# EAGLE design Motherboard (EAGLE 9.1.0)
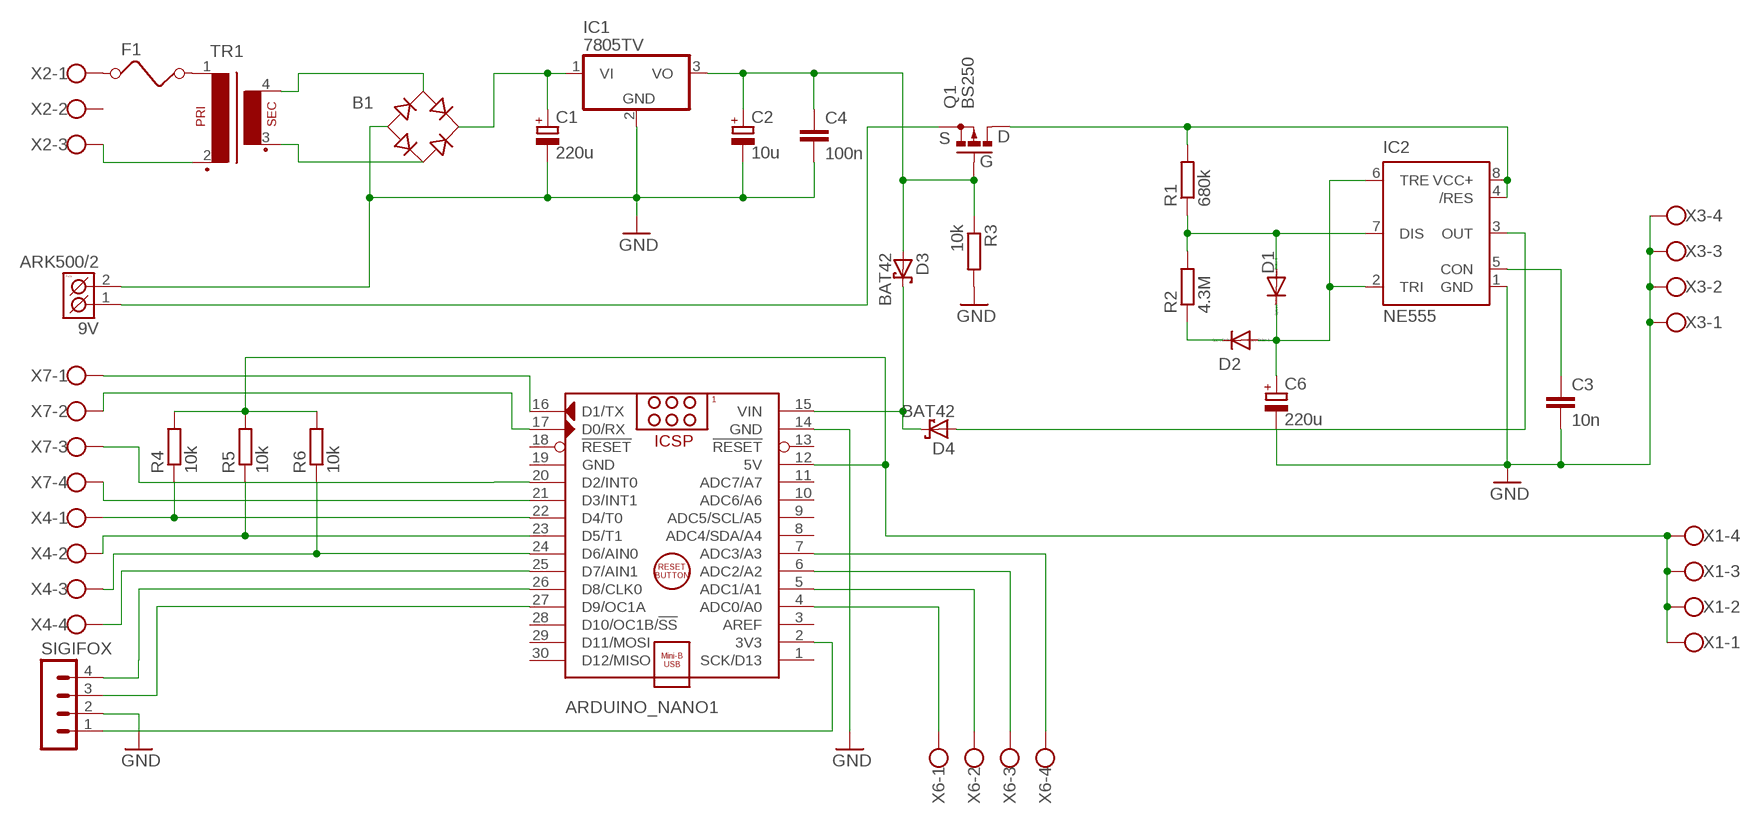
[diagram p0: schematic, sheet 1]

## Parts
9V  ARK500/2  [ARK500/2]
ARDUINO_NANO1  ARDUINO_NANO  [ARDUINO_NANO]
B1  RECTIFIER-RB1A  [RB1A]
C1  220u  CPOL-EUE5-13  [E5-13]
C2  10u  CPOL-EUE2,5-6E  [E2,5-6E]
C3  10n  C2.5/2  [C2.5-2]
C4  100n  C2.5/2  [C2.5-2]
C6  220u  CPOL-EUE5-13  [E5-13]
D1  1N4148DO35-7  [DO35-7]
D2  1N4148DO35-7  [DO35-7]
D3  BAT42  [DO35-10]
D4  BAT42  [DO35-10]
F1  FUSE  [FUSE]
IC1  7805TV  [TO220V]
IC2  NE555  [DIL-08]
Q1  BS250  [SOT54E]
R1  680k  R-EU_0207/5V  [0207/5V]
R2  4.3M  R-EU_0207/5V  [0207/5V]
R3  10k  R-EU_0207/5V  [0207/5V]
R4  10k  R-EU_0207/7  [0207/7]
R5  10k  R-EU_0207/7  [0207/7]
R6  10k  R-EU_0207/7  [0207/7]
SIGIFOX  MA04-1  [MA04-1]
TR1  VP31  [VP31]
X1  W237-4  [W237-4]
X2  W237-103  [W237-103]
X3  W237-4  [W237-4]
X4  W237-4  [W237-4]
X6  W237-4  [W237-4]
X7  W237-4  [W237-4]

## Nets
3V3: ARDUINO_NANO1.2(3V3) SIGIFOX.1
5V: ARDUINO_NANO1.12(5V) R4.2 R5.2 R6.2 X1.1 X1.2 X1.3 X1.4
9VN: B1.+ C1.+ IC1.1(VI)
A0: ARDUINO_NANO1.4(ADC0/A0) X6.1
A1: ARDUINO_NANO1.5(ADC1/A1) X6.2
A2: ARDUINO_NANO1.6(ADC2/A2) X6.3
A3: ARDUINO_NANO1.7(ADC3/A3) X6.4
D2: ARDUINO_NANO1.20(D2/INT0) X7.3
D3: ARDUINO_NANO1.21(D3/INT1) X7.4
D4: ARDUINO_NANO1.22(D4/T0) R4.1 X4.1
D5: ARDUINO_NANO1.23(D5/T1) R5.1 X4.2
D6: ARDUINO_NANO1.24(D6/AIN0) R6.1 X4.3
D7: ARDUINO_NANO1.25(D7/AIN1) X4.4
G: C2.+ C4.1 D3.A IC1.3(VO) Q1.G R3.1
GND: 9V.2(K2) ARDUINO_NANO1.14(GND) B1.- C1.- C2.- C3.2 C4.2 C6.- IC1.2(GND) IC2.1(GND) R3.2 SIGIFOX.2 X3.1 X3.2 X3.3 X3.4
N$1: D4.A IC2.3(OUT)
N$2: F1.2 TR1.1
N$3: D1.A IC2.7(DIS) R1.1 R2.2
N$6: C6.+ D1.C D2.A IC2.2(TRI) IC2.6(TRE)
N$8: C3.1 IC2.5(CON)
N$9: D2.C R2.1
N$10: F1.1 X2.1
N$12: B1.AC1 TR1.4(S4)
N$13: B1.AC2 TR1.3(S3)
N$15: TR1.2 X2.3
N$19: ARDUINO_NANO1.15(VIN) D3.C D4.C
RX: ARDUINO_NANO1.17(D0/RX) X7.2
S: 9V.1(K1) Q1.S
SIGIFOX_RX: ARDUINO_NANO1.27(D9/OC1A) SIGIFOX.3
SIGIFOX_TX: ARDUINO_NANO1.26(D8/CLK0) SIGIFOX.4
TX: ARDUINO_NANO1.16(D1/TX) X7.1
VCC: IC2.4(/RES) IC2.8(VCC+) Q1.D R1.2
Unconnected: ARDUINO_NANO1.1(SCK/D13) ARDUINO_NANO1.3(AREF) ARDUINO_NANO1.8(ADC4/SDA/A4) ARDUINO_NANO1.9(ADC5/SCL/A5) ARDUINO_NANO1.10(ADC6/A6) ARDUINO_NANO1.11(ADC7/A7) ARDUINO_NANO1.13(!RESET) ARDUINO_NANO1.18(!RESET) ARDUINO_NANO1.28(D10/OC1B/!SS) ARDUINO_NANO1.29(D11/MOSI) ARDUINO_NANO1.30(D12/MISO) X2.2

## Notes on the sheet
- S | D
- G

## Power pins joined to a net without a drawn wire
GND: ARDUINO_NANO1.19(GND)

## Library data of the parts
9V = #PaJa_konektory:ARK500/2: Svorkovnice - roztec 5mm - dvojita
ARDUINO_NANO1 = ArduinoNanoV30:ARDUINO_NANO: Arduino Nano V3.0 Module Overview: The Arduino Nano is a small, complete, and breadboard-friendly board based on the ATmega328 (Arduino Nano 3.x) or ATmega168 (Arduino Nano 2.x). It has more or less the same functionality of the Arduino Duemilanove, but in a different package. It lacks only a DC power jack, and works with a Mini-B USB cable instead of a standard one. The Nano was designed and is being produced by Gravitech <http://www.gravitech.us/arna30wiatp.html>. General specifications: Item Value Microcontroller Atmel ATmega168 or ATmega328 Operating Voltage (logic level) 5 V Input Voltage (recommended) 7-12 V Input Voltage (limits) 6-20 V Digital I/O Pins 14 (of which 6 provide PWM output) Analog Input Pins 8 DC Current per I/O Pin 40 mA Flash Memory 16 KB (ATmega168) or 32 KB (ATmega328) of which 2 KB used by bootloader SRAM 1 KB (ATmega168) or 2 KB (ATmega328) EEPROM 512 bytes (ATmega168) or 1 KB (ATmega328) Clock Speed 16 MHz Dimensions (Inches) 0.73" x 1.70" Dimensions (mm) 18mm x 45mm Overall height About 9 mm (not including pins) Weigth 5 g Power: The Arduino Nano can be powered via the Mini-B USB connection, 6-20V unregulated external power supply (pin 30), or 5V regulated external power supply (pin 27). The power source is automatically selected to the highest voltage source. Memory: The ATmega168 has 16 KB of flash memory for storing code (of which 2 KB is used for the bootloader); the ATmega328 has 32 KB, (also with 2 KB used for the bootloader). The ATmega168 has 1 KB of SRAM and 512 bytes of EEPROM (which can be read and written with the EEPROM library); the ATmega328 has 2 KB of SRAM and 1 KB of EEPROM. Input and Output: Each of the 14 digital pins on the Nano can be used as an input or output, using pinMode(), digitalWrite(), and digitalRead() functions. They operate at 5 volts. Each pin can provide or receive a maximum of 40 mA and has an internal pull-up resistor (disconnected by default) of 20-50 kOhms. In addition, some pins have specialized functions. Visit Arduino - ArduinoBoardNano <https://www.arduino.cc/en/Main/ArduinoBoardNano>
B1 = rectifier:RECTIFIER-: Rectifier
C1 C2 C6 = rcl:CPOL-EU: POLARIZED CAPACITOR, European symbol; SPICEPREFIX: C
C3 C4 = capacitor-wima:C: CAPACITOR naming: grid - package width
D1 D2 = diode:1N4148: DIODE high speed (Philips)
D3 D4 = diode:BAT42: DIODE barrier diode
F1 = special:FUSE: FUSE 5 x 20 mm
IC1 = linear:78*: Positive VOLTAGE REGULATOR Source: http://cache.national.com/ds/LM/LM78L05.pdf http://www.fairchildsemi.com/ds/LM/LM7805.pdf
IC2 = st-microelectronics:NE555: General purpose bipolar Timer; MF: Arrow Electronics; MPN: NE555N; OC_FARNELL: 1467742; OC_NEWARK: 89K1486
Q1 = transistor-small-signal:BS250: P-CHANNEL MOS FET
R1-R3 = resistor:R-EU_: RESISTOR, European symbol
R4-R6 = rcl:R-EU_: RESISTOR, European symbol; SPICEPREFIX: R
SIGIFOX = con-lstb:MA04-1: PIN HEADER; OC_FARNELL: unknown; OC_NEWARK: unknown
TR1 = trafo:VP31: TRANSFORMER 1 primary winding, 1 secondary winding BLOCK
X1 X3 X4 X6 X7 = con-wago-500:W237-4: WAGO SCREW CLAMP; OC_FARNELL: unknown; OC_NEWARK: unknown
X2 = con-wago-500:W237-103: WAGO SCREW CLAMP; MPN: 237-103; OC_FARNELL: unknown; OC_NEWARK: 18M7116

## Board
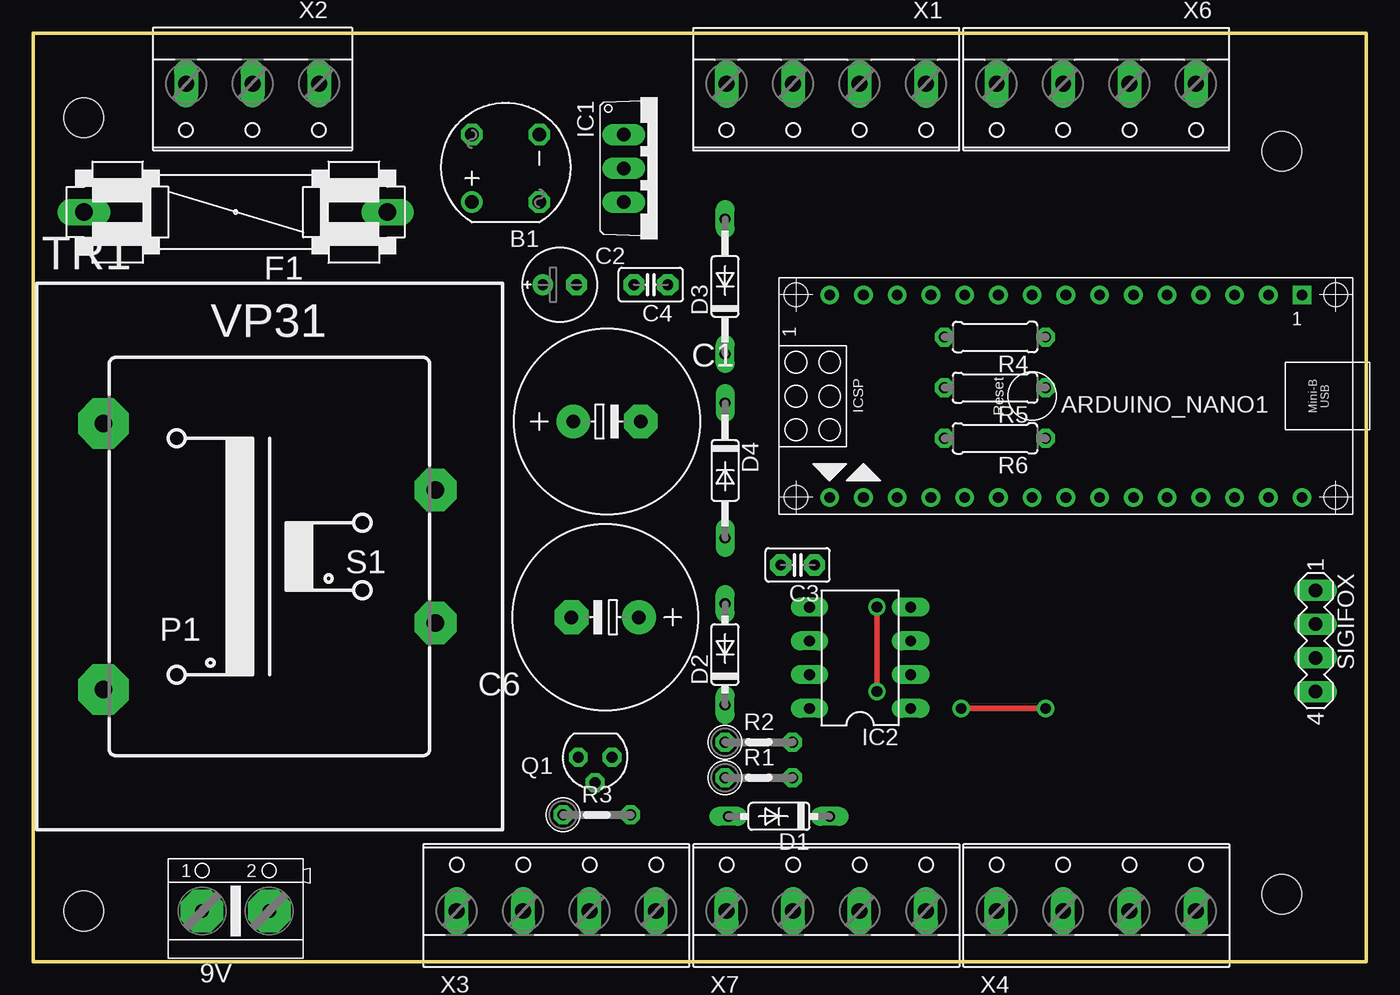
[diagram p1: board, top side]
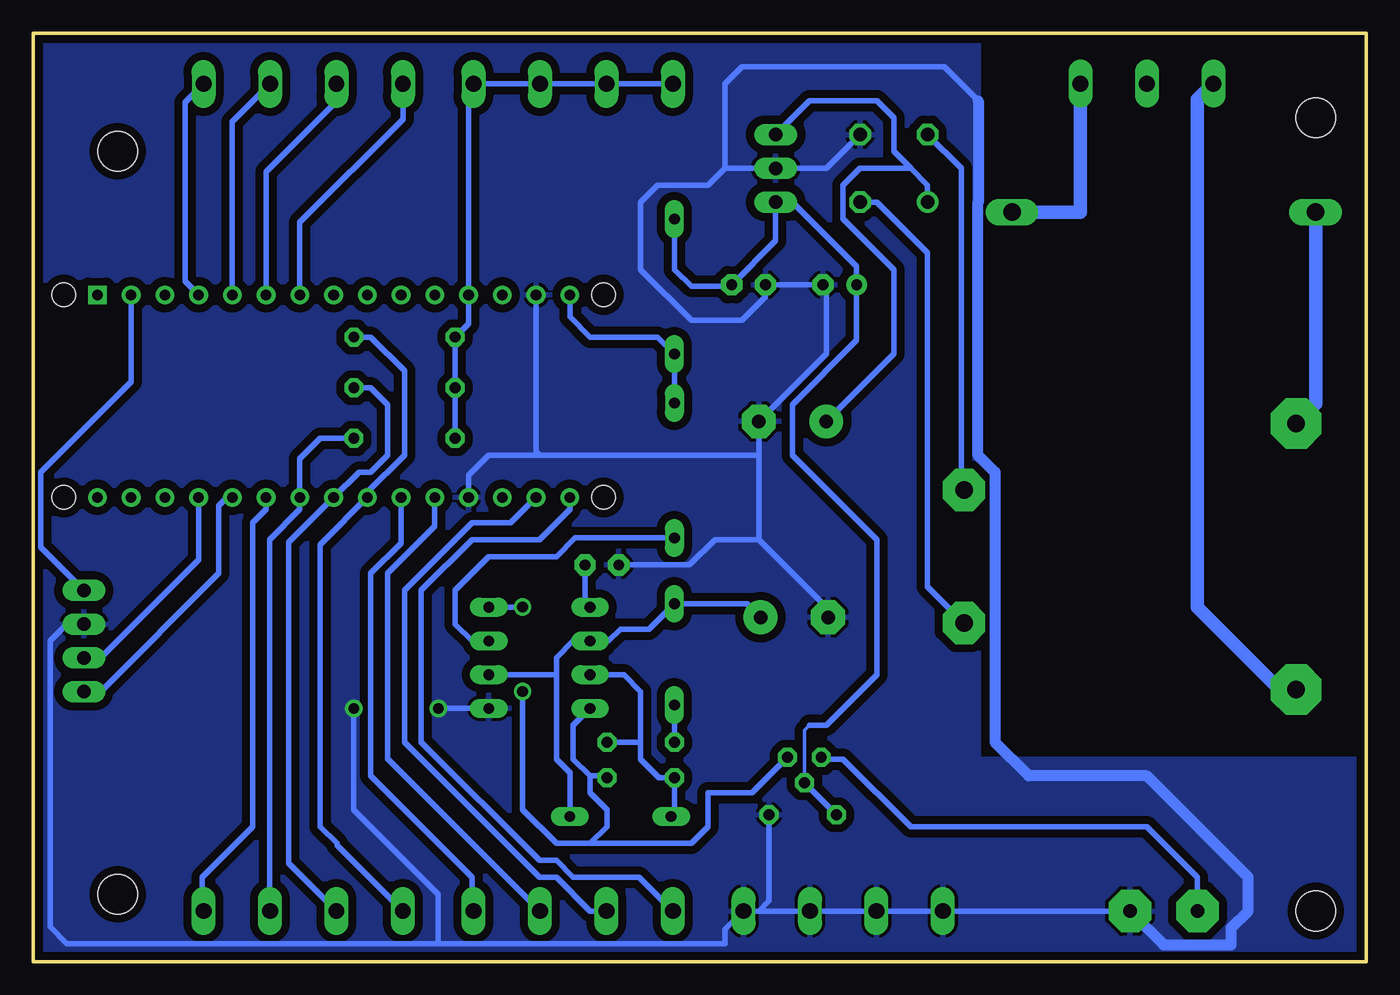
[diagram p2: board, bottom side, seen from below]

Size 100.33 x 69.85 mm. Coordinates in mm from the lower left corner, seen from the top.
Outline: 0,0 100.33,0 100.33,69.85 0,69.85 0,0
Copper layers (1*16): Top 0.035mm / dielectric 1.5mm / Bottom 0.035mm
Design rules "SparkFun": minimum track width 8mil, minimum drill 20mil, track to track 8mil, track to pad 8mil, pad to pad 8mil, via to via 8mil, smd to smd 8mil, copper to edge 10mil, drill to drill 8mil, minimum pad ring 12mil, minimum via ring 10mil, stop-mask expansion 4mil, vias tented up to drill 25mil, thermal gap 10mil
Holes 3 mm at 3.81,3.81 93.98,5.08 3.81,63.5 93.98,60.96

### Footprints (pad centres in the part's own frame; a part is rotated, then mirrored left to right if it is on the bottom)
ARK500/2 = drill 1 pad 3.2 octagon: 1 -2.54,0; 2 2.54,0
ARDUINO_NANO = drill 0.8 square: 1 -20.32,-7.62 | drill 0.8: 2 -17.78,-7.62; 3 -15.24,-7.62; 4 -12.7,-7.62; 5 -10.16,-7.62; 6 -7.62,-7.62; 7 -5.08,-7.62; 8 -2.54,-7.62; 9 0,-7.62; 10 2.54,-7.62; 11 5.08,-7.62; 12 7.62,-7.62; 13 10.16,-7.62; 14 12.7,-7.62; 15 15.24,-7.62; 16 15.24,7.62; 17 12.7,7.62; 18 10.16,7.62; 19 7.62,7.62; 20 5.08,7.62; 21 2.54,7.62; 22 0,7.62; 23 -2.54,7.62; 24 -5.08,7.62; 25 -7.62,7.62; 26 -10.16,7.62; 27 -12.7,7.62; 28 -15.24,7.62; 29 -17.78,7.62; 30 -20.32,7.62 | hole 1.778: -22.86,-7.62; -22.86,7.62; 17.78,7.62; 17.78,-7.62
RB1A = drill 1.016: + -2.54,2.54 | drill 1.016 octagon: - 2.54,-2.54; AC1 2.54,2.54; AC2 -2.54,-2.54
E5-13 = drill 1.016 pad 2.54: + -2.54,0 | drill 1.016 pad 2.54 octagon: - 2.54,0
E2,5-6E = drill 0.813 pad 1.575: + -1.27,0 | drill 0.813 pad 1.575 octagon: - 1.27,0
C2.5-2 = drill 0.813 pad 1.6 octagon: 1 -1.27,0; 2 1.27,0
DO35-7 = drill 0.813 long: A 3.81,0; C -3.81,0
DO35-10 = drill 0.813 long: A 5.08,0; C -5.08,0
FUSE = drill 1.321 long: 1 -11.43,0; 2 11.43,0
TO220V = drill 1.016 long: 1 -2.54,-2.54; 2 0,-2.54; 3 2.54,-2.54
DIL-08 = drill 0.813 long: 1 -3.81,-3.81; 2 -1.27,-3.81; 3 1.27,-3.81; 4 3.81,-3.81; 5 3.81,3.81; 6 1.27,3.81; 7 -1.27,3.81; 8 -3.81,3.81
SOT54E = drill 0.813 octagon: D -1.27,0; G 0,1.905; S 1.27,0
0207/5V = drill 0.813 octagon: 1 -2.54,0; 2 2.54,0
0207/7 = drill 0.813 octagon: 1 -3.81,0; 2 3.81,0
MA04-1 = drill 1.016 long: 1 -3.81,0; 2 -1.27,0; 3 1.27,0; 4 3.81,0
VP31 = drill 1.321 pad 3.81 octagon: 1 -12.497,10.008; 2 -12.497,-10.008 | drill 1.321 pad 3.175 octagon: 3 12.497,-5.004; 4 12.497,5.004
W237-4 = drill 1.194 long: 1 -7.5,-1.27; 2 -2.5,-1.27; 3 2.5,-1.27; 4 7.5,-1.27
W237-103 = drill 1.194 long: 1 -5,-1.29; 2 0,-1.29; 3 5,-1.29

### Placement (x,y rotation side)
9V  15.24,3.81 0 top
ARDUINO_NANO1  75.18,42.55 180 top
B1  35.56,59.69 90 top
C1  43.18,40.64 0 top
C2  39.62,50.93 0 top
C3  57.53,29.84 180 top
C4  46.48,50.93 180 top
C6  43.05,25.91 180 top
D1  56.13,10.92 180 top
D2  52.07,23.11 90 top
D3  52.07,50.8 90 top
D4  52.07,36.96 270 top
F1  15.24,56.39 180 top
IC1  46.99,59.69 270 top
IC2  62.23,22.86 90 top
Q1  42.29,15.37 180 top
R1  54.61,13.84 0 top
R2  54.61,16.51 0 top
R3  42.42,11.05 0 top
R4  72.39,46.99 180 top
R5  72.39,43.18 180 top
R6  72.39,39.37 180 top
SIGIFOX  96.52,24.13 270 top
TR1  17.78,30.48 0 top
X1  59.69,64.77 180 top
X2  16.51,64.77 180 top
X3  39.37,5.08 0 top
X4  80.01,5.08 0 top
X6  80.01,64.77 180 top
X7  59.69,5.08 0 top

### Tracks (layer width: path | path; a pad name or v marks a point on that pad's centre or on a via)
3V3
  Bottom 0.406: ARDUINO_NANO1.2 92.96,43.61 99.75,36.83 99.75,31.17 SIGIFOX.1
5V
  Bottom 0.406: X1.4 X1.3 X1.2 X1.1 67.56,65.67 ARDUINO_NANO1.12 67.56,48.01 R4.2 R5.2 R6.2
9VN
  Bottom 0.406: B1.+ 33.02,58.42 34.29,59.69 | 34.29,59.69 35.56,60.96 35.56,63.5 36.83,64.77 41.91,64.77 IC1.1 | 34.29,59.69 38.1,59.69 39.37,58.42 39.37,55.88 35.56,52.07 35.56,45.72 C1.+
A0
  Bottom 0.406: ARDUINO_NANO1.4 88.9,51.18 88.9,64.65 X6.1
A1
  Bottom 0.406: ARDUINO_NANO1.5 85.34,63.21 X6.2
A2
  Bottom 0.406: ARDUINO_NANO1.6 82.8,59.44 77.51,64.73 X6.3
A3
  Bottom 0.406: X6.4 72.51,63.38 80.26,55.63 ARDUINO_NANO1.7
D2
  Bottom 0.406: X7.3 73.62,15.24 73.66,15.24 73.66,29.21 70.1,32.77 ARDUINO_NANO1.20
D3
  Bottom 0.406: X7.4 67.31,3.93 67.31,6.35 74.93,13.97 74.93,29.21 72.64,31.5 ARDUINO_NANO1.21
D4
  Bottom 0.406: R4.1 74.93,46.99 72.39,44.45 72.39,38.1 75.18,35.31 ARDUINO_NANO1.22 78.55,31.56 78.74,31.37 78.74,10.16 77.47,8.89 77.47,8.77 X4.1
D5
  Bottom 0.406: R5.1 74.93,43.18 73.66,41.91 73.66,38.1 74.93,36.83 75.82,36.83 ARDUINO_NANO1.23 81.09,31.56 81.09,7.39 X4.2
D6
  Bottom 0.406: 82.55,3.85 X4.3 82.55,3.85 | R6.1 78.74,39.37 80.26,37.85 ARDUINO_NANO1.24 80.26,34.04 82.55,31.75 82.55,3.85
D7
  Bottom 0.406: ARDUINO_NANO1.25 82.8,34.04 83.82,33.02 83.82,10.16 87.63,6.35 87.63,3.93 X4.4
G
  Bottom 0.254: Q1.G 42.29,17.4 41.91,17.78
  Bottom 0.406: D3.A 52.07,52.07 50.8,50.8 47.88,50.8 C4.1 44.45,54.23 IC1.3 43.18,57.15 38.35,52.32 C2.+ 38.35,46.74 43.18,41.91 43.18,38.1 36.83,31.75 36.83,21.59 40.64,17.78 41.91,17.78 | R3.1 Q1.G
GND  (via drill 0.8)
  Top 0.406: v76.2,19.05 v69.85,19.05
  Bottom 0.406: 45.72,3.81 X3.3 41.91,3.81 X3.2 X3.1 9V.2 | 45.72,3.81 X3.4 48.26,2.42 48.26,1.35 59.69,1.35 64.77,1.35 69.85,1.35 | B1.- 40.64,59.69 IC1.2 48.26,59.69 | 48.26,59.69 49.53,58.42 53.34,58.42 54.61,57.15 54.61,52.07 50.8,48.26 46.99,48.26 45.21,50.04 C4.2 C2.- 40.64,50.67 40.64,45.72 C1.- 45.72,38.1 | R3.2 44.96,4.57 45.72,3.81 | 45.72,38.1 45.72,36.83 45.72,31.75 | C3.2 50.93,29.84 49.02,31.75 45.72,31.75 | 69.85,1.35 97.79,1.35 99.06,2.62 99.06,24.13 97.79,25.4 SIGIFOX.2 | 69.85,1.35 69.85,5.08 76.2,11.43 v76.2,19.05 | v69.85,19.05 IC2.1 | 45.72,38.1 62.23,38.1 | 62.23,38.1 66.04,38.1 67.56,36.58 ARDUINO_NANO1.19 | ARDUINO_NANO1.14 62.48,38.35 62.23,38.1 | C6.- 40.51,26.54 45.72,31.75 | 48.26,59.69 48.26,66.04 46.99,67.31 31.75,67.31 29.21,64.77
  Bottom 0.813: 9V.2 15.24,1.27 10.16,1.27 10.16,2.54 8.89,3.81 8.89,6.35 16.51,13.97 25.4,13.97 27.94,16.51 27.94,36.83 29.26,38.15 29.26,57.05 29.21,57.1 29.21,64.77
  pour Bottom (isolate 0.61): -1.27,-1.27 101.6,-1.27 101.6,71.12 29.21,71.12 29.21,15.24 -1.27,15.24
N$1
  Bottom 0.406: IC2.3 67.31,24.13 68.58,25.4 68.58,27.94 66.04,30.48 60.96,30.48 59.56,31.88 D4.A
N$2
  Bottom 1.016: TR1.1 3.81,41.96 F1.2
N$3
  Bottom 0.406: D1.A 52.07,11.18 R1.1 53.21,13.84 54.61,15.24 54.61,16.51 | IC2.7 55.88,21.59 54.61,20.32 54.61,16.51 | 54.61,16.51 R2.2
N$6
  Bottom 0.406: D1.C 59.94,14.22 60.96,15.24 60.96,21.59 | 60.96,21.59 60.96,22.86 59.69,24.13 IC2.6 57.02,24.13 56.13,25.02 53.98,25.02 D2.A 46.61,26.92 C6.+ | IC2.2 60.96,21.59
N$8
  Bottom 0.406: IC2.5 58.8,27.05 C3.1
N$9
  Bottom 0.406: D2.C R2.1
N$10
  Bottom 1.016: F1.1 21.51,56.39 X2.1
N$12
  Bottom 0.406: TR1.4 30.48,35.69 30.48,59.69 B1.AC1
N$13
  Bottom 0.406: TR1.3 33.02,28.22 33.02,53.34 36.83,57.15 B1.AC2
N$15
  Bottom 1.016: X2.3 12.7,64.87 12.7,26.67 6.5,20.47 TR1.2
N$19
  Bottom 0.406: D4.C D3.C 53.34,46.99 58.42,46.99 59.94,48.51 ARDUINO_NANO1.15
RX
  Bottom 0.406: X7.2 58.42,3.81 60.96,6.35 62.23,6.35 72.39,16.51 72.39,27.94 67.31,33.02 64.39,33.02 ARDUINO_NANO1.17
S
  Bottom 0.406: 9V.1 12.7,6.35 16.51,10.16 34.29,10.16 39.37,15.24 40.89,15.24 Q1.S
SIGIFOX_RX
  Bottom 0.406: ARDUINO_NANO1.27 87.88,30.23 95.25,22.86 SIGIFOX.3
SIGIFOX_TX
  Bottom 0.406: ARDUINO_NANO1.26 85.72,34.92 86.36,34.29 86.36,29.21 95.25,20.32 SIGIFOX.4
TX
  Bottom 0.406: X7.1 54.73,6.35 59.69,6.35 60.96,7.62 62.23,7.62 71.12,16.51 71.12,27.94 67.31,31.75 62.23,31.75 59.94,34.04 ARDUINO_NANO1.16
VCC  (via drill 0.8)
  Top 0.406: v63.5,26.67 v63.5,20.32
  Bottom 0.406: Q1.D 46.23,12.7 49.53,12.7 49.53,10.16 50.8,8.89 58.42,8.89 | IC2.8 59.69,17.78 59.69,15.24 58.42,13.97 | 58.42,13.97 58.42,12.7 57.15,11.43 57.15,10.16 58.42,8.89 | 58.42,8.89 60.96,8.89 63.5,11.43 v63.5,20.32 | IC2.4 v63.5,26.67 | R1.2 57.28,13.97 58.42,13.97